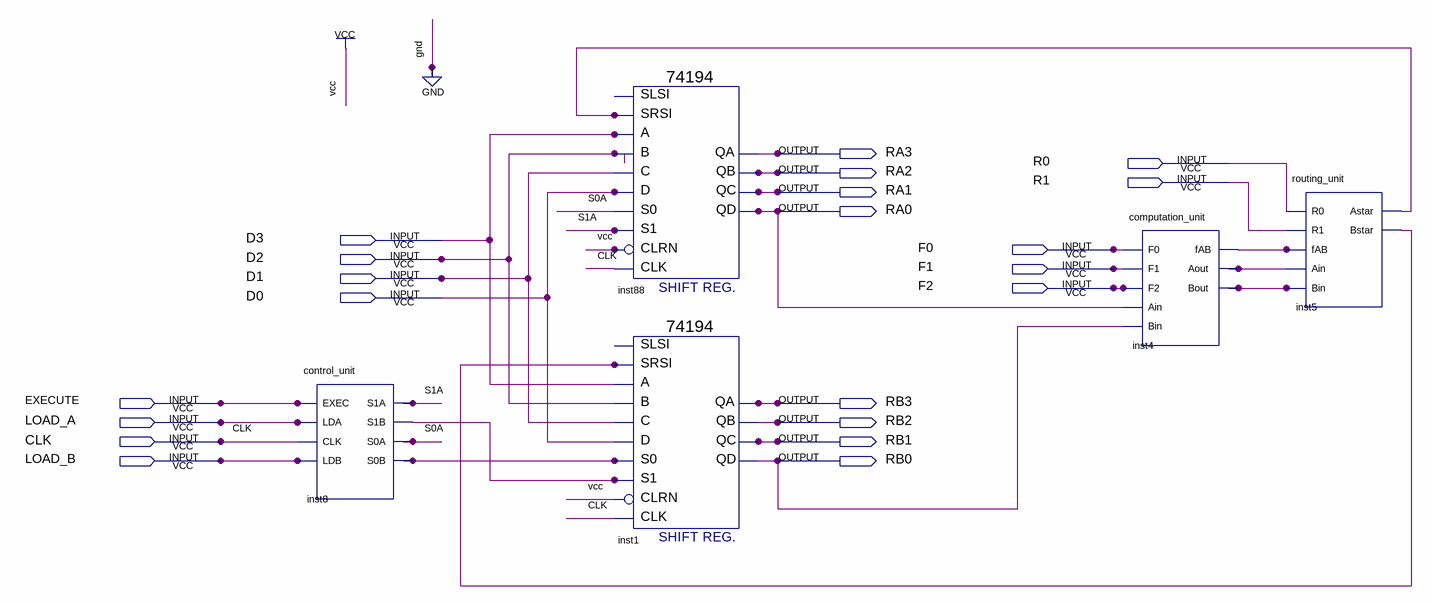
[diagram p0: schematic sheet]
// Quartus schematic lab3.bdf as structural Verilog: 5 symbols, 21 pins
module lab3 (
  input  R0,
  input  R1,
  input  D3,
  input  F0,
  input  D2,
  input  F1,
  input  D1,
  input  F2,
  input  D0,
  input  EXECUTE,
  input  LOAD_A,
  input  CLK,
  input  LOAD_B,
  output RA3,
  output RA2,
  output RA1,
  output RA0,
  output RB3,
  output RB2,
  output RB1,
  output RB0
);

  wire inst4_aout, inst4_bout, inst4_fab, inst5_astar, inst5_bstar, inst8_s0b, inst8_s1b, S0A, S1A;

  control_unit inst8 (
    .EXEC(EXECUTE), .LDA(LOAD_A), .CLK(CLK), .LDB(LOAD_B), .S1A(S1A), .S1B(inst8_s1b), .S0A(S0A),
    .S0B(inst8_s0b));
  \74194  inst88 (
    .SRSI(inst5_astar), .B(D2), .C(D1), .CLK(CLK), .CLRN(1'b1), .D(D0), .S1(S1A), .S0(S0A), .A(D3), .QA(RA3),
    .QB(RA2), .QC(RA1), .QD(RA0));  // open: SLSI
  \74194  inst1 (
    .SRSI(inst5_bstar), .B(D2), .C(D1), .CLK(CLK), .CLRN(1'b1), .D(D0), .S1(inst8_s1b), .S0(inst8_s0b),
    .A(D3), .QA(RB3), .QB(RB2), .QC(RB1), .QD(RB0));  // open: SLSI
  computation_unit inst4 (
    .F0(F0), .F1(F1), .F2(F2), .Ain(RA0), .Bin(RB0), .fAB(inst4_fab), .Aout(inst4_aout), .Bout(inst4_bout));
  routing_unit inst5 (
    .R0(R0), .R1(R1), .fAB(inst4_fab), .Ain(inst4_aout), .Bin(inst4_bout), .Astar(inst5_astar),
    .Bstar(inst5_bstar));
endmodule
